# EasyEDA Pro project thighPCB.epro

# Schematic Schematic1
Board Name: Board1; Create Date: 2026-03-03; Page Name: P1; Project Name: MCU&Thigh_v2; Schematic Name: Schematic1; Update Date: 2026-03-04; BladeWidth: 10; Company: 嘉立创EDA; Page Size: A4; RegionStart: 1; ShowBorder: 1; TitleBlock: 1; TitleBlockPosition: 3; Version: V1.0; XRegionCount: 6; YRegionCount: 4
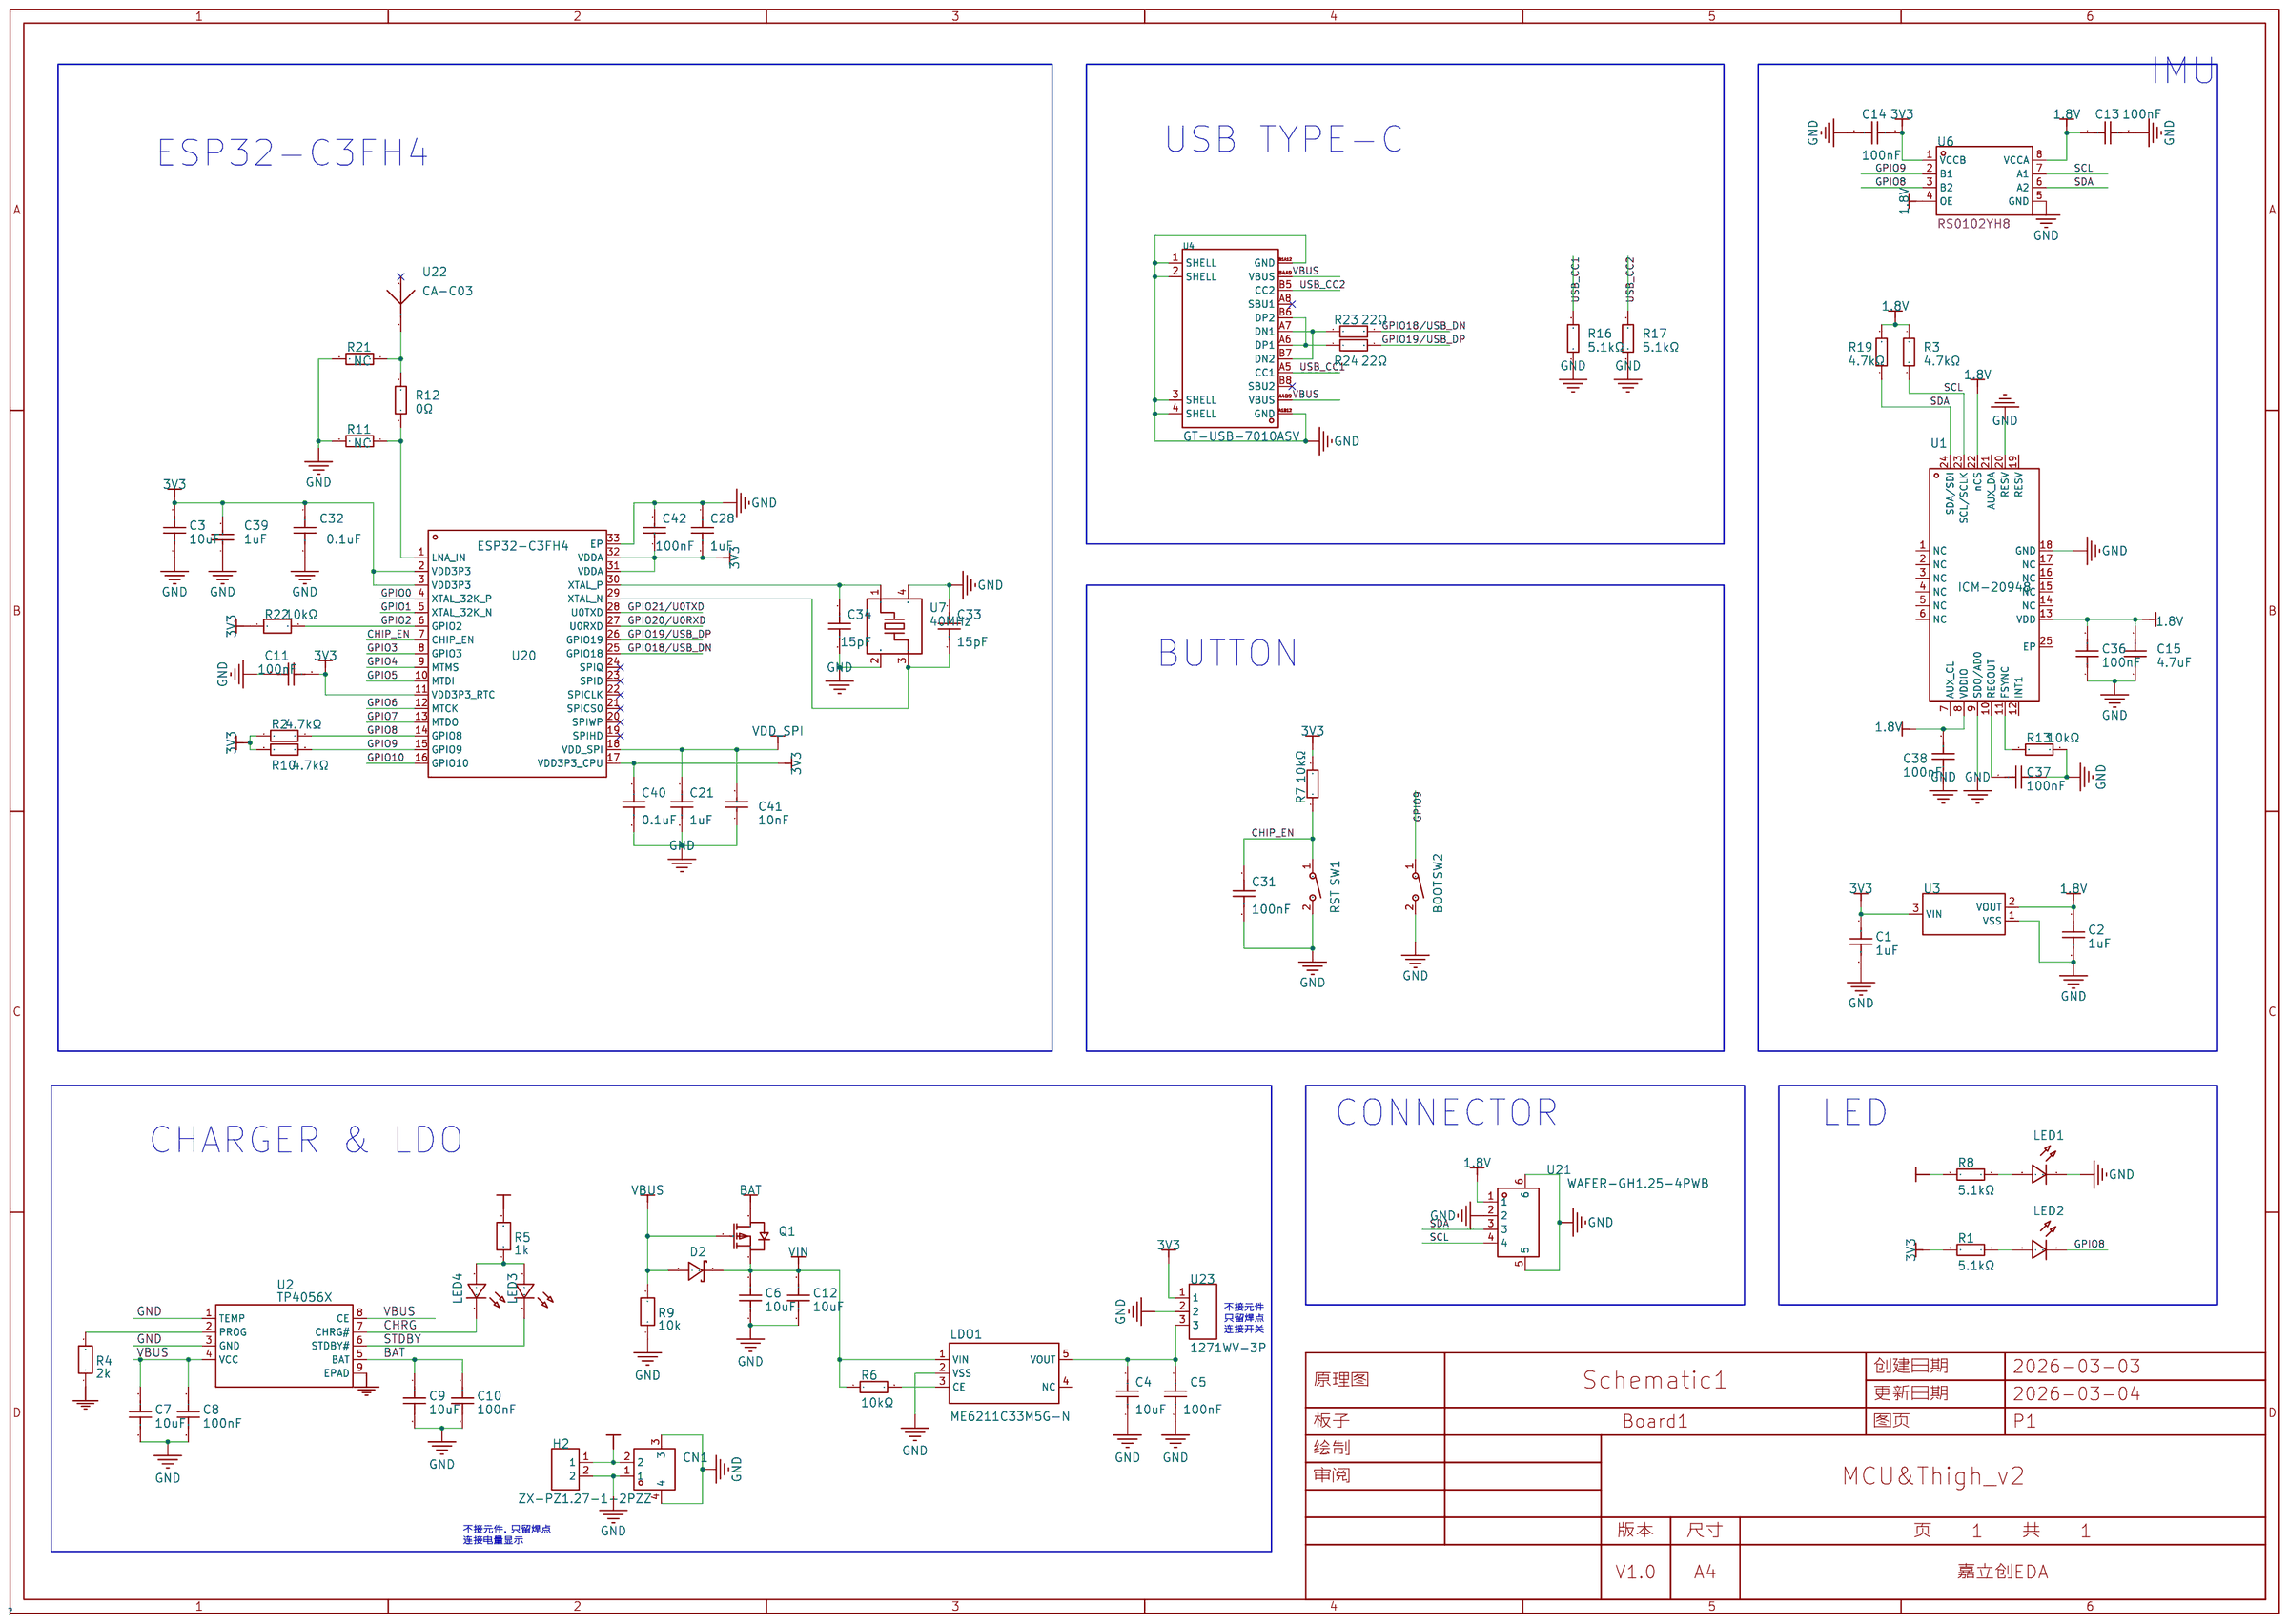
[diagram p0: schematic sheet]

## Parts
C1  1uF  [C0402]
C2  1uF  [C0402]
C3  10uF  [C0402]
C4  10uF  [C0402]
C5  100nF  [C0402]
C6  10uF  [C0402]
C7  10uF  [C0402]
C8  100nF  [C0402]
C9  10uF  [C0402]
C10  100nF  [C0402]
C11  100nF  [C0201]
C12  10uF  [C0402]
C13  100nF  [C0201]
C14  100nF  [C0201]
C15  4.7uF  [C0201]
C21  1uF  [C0201]
C28  1uF  [C0201]
C31  100nF  [C0201]
C32  0.1uF  [C0201]
C33  15pF  [C0201]
C34  15pF  [C0201]
C36  100nF  [C0201]
C37  100nF  [C0201]
C38  100nF  [C0201]
C39  1uF  [C0201]
C40  0.1uF  [C0201]
C41  10nF  [C0201]
C42  100nF  [C0201]
CN1  WAFER-GH1.25-2PWB  [CONN-TH_2P-P1.25_XUNPU_WAFER-GH1.25-2PWB]
D2  1N5819HW-7-F  [SOD-123_L2.7-W1.6-LS3.7-RD]
H2  ZX-PZ1.27-1-2PZZ  [HDR-TH_2P-P1.27-V-M-2]  (no BOM)
LDO1  ME6211C33M5G-N  [SOT-23-5_L3.0-W1.7-P0.95-LS2.8-BL]
LED1  -  [LED_0402]
LED2  -  [LED_0402]
LED3  -  [LED_0402]
LED4  -  [LED_0402]
Q1  HL6042  [SOT-23-3_L2.9-W1.4-P1.90-LS2.5-BR]
R1  5.1kΩ  [R0402]
R2  4.7kΩ  [R0201]
R3  4.7kΩ  [R0201]
R4  2k  [R0402]
R5  1k  [R0402]
R6  10kΩ  [R0402]
R7  10kΩ  [R0201]
R8  5.1kΩ  [R0402]
R9  10k  [R0402]
R10  4.7kΩ  [R0201]
R11  NC  [R0201]  (no BOM)
R12  0Ω  [R0201]
R13  10kΩ  [R0201]
R16  5.1kΩ  [R0201]
R17  5.1kΩ  [R0201]
R19  4.7kΩ  [R0201]
R21  NC  [R0201]  (no BOM)
R22  10kΩ  [R0201]
R23  22Ω  [R0201]
R24  22Ω  [R0201]
SW1  RST  [SW-SMD_L4.0-W2.9-LS5.0]
SW2  BOOT  [SW-SMD_L4.0-W2.9-LS5.0]
U1  ICM-20948  [QFN-24_L3.0-W3.0-P0.40-BL-EP]
U2  TP4056X  [SOP-8_L4.9-W3.9-P1.27-LS6.0-BL-EP]
U3  ME6211A18M3G-N  [SOT-23-3_L3.0-W1.7-P0.95-LS2.9-BR]
U4  GT-USB-7010ASV  [USB-C-SMD_G-SWITCH_GT-USB-7010ASV]
U6  RS0102YH8  [SOT-23-8_L3.0-W1.7-P0.65-LS2.8-BL]
U7  40MHz  [CRYSTAL-SMD_4P-L2.0-W1.6-BL]
U20  ESP32-C3FH4  [QFN-32_L5.0-W5.0-P0.50-TL-EP3.7]
U21  WAFER-GH1.25-4PWB  [CONN-SMD_4P-P1.25_XUNPU_WAFER-GH1.25-4PWB]
U22  CA-C03  [ANT-SMD_CA-C03]
U23  1271WV-3P  [HDR-TH_3P-P1.27-V-M]  (no BOM)

## Library data of the parts
C1 C2 C6-C10 C12 = CAP_0603: Supplier Footprint: 0603
C3 = CL05A106MP5NUNC: 容值:10uF;精度:±20%;额定电压:10V;温度系数:X5R;; LCSC Part Name: 10uF ±20% 10V; Supplier Part: C315248; Manufacturer: SAMSUNG(三星); Supplier Footprint: 0402; JLCPCB Part Class: Extended Part; Datasheet: https://item.szlcsc.com/datasheet/CL05A106MP5NUNC/297154.html; Supplier: LCSC; Tolerance: ±20%; Voltage Rating: 10V; Temperature Coefficient: X5R
C4 = CL10A106KP8NNNC: 容值:10uF;精度:±10%;额定电压:10V;材质(温度系数):X5R;; LCSC Part Name: 10uF ±10% 10V; Supplier Part: C19702; Manufacturer: SAMSUNG(三星); Supplier Footprint: 0603; JLCPCB Part Class: Basic Part; Datasheet: https://atta.szlcsc.com/upload/public/pdf/source/20160218/1457707763339.pdf; Supplier: LCSC; Tolerance: ±10%; Voltage Rated: 10V; Temperature Coefficient: X5R
C5 = CGA0603X7R104K500JT: 容值:100nF;精度:±10%;额定电压:50V;材质(温度系数):X7R;; LCSC Part Name: 100nF ±10% 50V; Supplier Part: C6119867; Manufacturer: HRE(芯声); Supplier Footprint: 0603; JLCPCB Part Class: Extended Part; Supplier: LCSC; Tolerance: ±10%; Voltage Rated: 50V; Temperature Coefficient: X7R
C11 C13 C14 C31 C32 = GRM033Z71A104KE14D: 容值:100nF;精度:±10%;额定电压:10V;材质(温度系数):X7R;; LCSC Part Name: 100nF ±10% 10V; Supplier Part: C161494; Manufacturer: muRata(村田); Supplier Footprint: 0201; JLCPCB Part Class: Extended Part; Datasheet: https://atta.szlcsc.com/upload/public/pdf/source/20181119/C161494_7C14CD1E604AF2690E90D16E0278156D.pdf; Supplier: LCSC; Tolerance: ±10%; Voltage Rated: 10V; Temperature Coefficient: X7R
C15 C36-C38 = CL03A104KO3NNNC: 容值:100nF;精度:±10%;额定电压:16V;温度系数:X5R;; LCSC Part Name: 100nF ±10% 16V; Supplier Part: C307380; Manufacturer: SAMSUNG(三星); Supplier Footprint: 0201; JLCPCB Part Class: Extended Part; Datasheet: https://item.szlcsc.com/datasheet/CL03A104KO3NNNC/291054.html; Supplier: LCSC; Tolerance: ±10%; Voltage Rating: 16V; Temperature Coefficient: X5R
C21 C28 C40 = GRM033C81A105ME05D: 容值:1uF;精度:±20%;额定电压:10V;材质(温度系数):X6S;; LCSC Part Name: 1uF ±20% 10V; Supplier Part: C237278; Manufacturer: muRata(村田); Supplier Footprint: 0201; JLCPCB Part Class: Extended Part; Datasheet: https://atta.szlcsc.com/upload/public/pdf/source/20190513/C237278_F3358F26ECB1FE4E7B7A47CC66295717.pdf; Supplier: LCSC; Tolerance: ±20%; Voltage Rated: 10V; Temperature Coefficient: X6S
C33 C34 = GRM0335C1H150FA01D: 容值:15pF;精度:±1%;额定电压:50V;材质(温度系数):C0G;; LCSC Part Name: 15pF ±1% 50V; Supplier Part: C237567; Manufacturer: muRata(村田); Supplier Footprint: 0201; JLCPCB Part Class: Extended Part; Datasheet: https://atta.szlcsc.com/upload/public/pdf/source/20190415/C237567_28BDE19A6D5FCDC5F5E36ABAB8C70B61.pdf; Supplier: LCSC; Tolerance: ±1%; Voltage Rated: 50V; Temperature Coefficient: C0G
C39 = GRM033R61A105ME44D: 容值:1uF;精度:±20%;额定电压:10V;温度系数:X5R;; LCSC Part Name: 1uF ±20% 10V; Supplier Part: C76935; Manufacturer: muRata(村田); Supplier Footprint: 0201; JLCPCB Part Class: Extended Part; Datasheet: https://item.szlcsc.com/datasheet/GRM033R61A105ME44D/78062.html; Supplier: LCSC; Tolerance: ±20%; Voltage Rating: 10V; Temperature Coefficient: X5R
C41 = GRM033R71A103KA01D: 容值:10nF;精度:±10%;额定电压:10V;材质(温度系数):X7R;; LCSC Part Name: 10nF ±10% 10V; Supplier Part: C76941; Manufacturer: muRata(村田); Supplier Footprint: 0201; JLCPCB Part Class: 扩展库; Datasheet: https://atta.szlcsc.com/upload/public/pdf/source/20180307/C76941_15204091038901407729.pdf; Supplier: LCSC; Tolerance: ±10%; Voltage Rated: 10V; Temperature Coefficient: X7R
C42 = GRM033R61E104KE14D: 容值:100nF;精度:±10%;额定电压:25V;温度系数:X5R;; LCSC Part Name: 100nF ±10% 25V; Supplier Part: C76939; Manufacturer: muRata(村田); Supplier Footprint: 0201; JLCPCB Part Class: 扩展库; Datasheet: https://item.szlcsc.com/datasheet/GRM033R61E104KE14D/78066.html; Supplier: LCSC; Tolerance: ±10%; Voltage Rating: 25V; Temperature Coefficient: X5R
CN1 = WAFER-GH1.25-2PWB: 插针结构:1x2P;间距:1.25mm;安装方式:卧贴;参考系列:GH;总PIN数:2P;排数:1;每排PIN数:2;行距:-;额定电流:1A;触头材质:黄铜;触头镀层:锡;工作温度:-25℃~+85℃;; LCSC Part Name: 1x2P 间距:1.25mm 卧贴 系列:GH; Supplier Part: C3029377; Manufacturer: XUNPU(讯普); Supplier Footprint: SMD,P=1.25mm,卧贴; JLCPCB Part Class: Extended Part; Datasheet: https://item.szlcsc.com/datasheet/WAFER-GH1.25-2PWB/3561389.html; Supplier: LCSC; Pins Structure: 1x2P; Pitch: 1.25mm; Mounting Type: 卧贴; Reference Series: GH; Number of Pins: 2P; Number of Rows: 1; Number of PINs Per Row: 2; Current Rating: 1A; Contact Material: 黄铜; Contact Plating: 锡; Operating Temperature: -25℃~+85℃; Voltage Rating: 125V; Plastic Material: LCP; Supplementary Features: 辅助焊脚; Color: 米色; Z-Height of the Board: 4.35mm; X-Length of Bottom Edge on Board (Spacing Line): 5.75mm; Y-Width of Bottom Edge on Board: 5mm
D2 = 1N5819HW-7-F: 二极管配置:1个独立式;正向压降(Vf):450mV@1A;直流反向耐压(Vr):40V;整流电流:1A;; LCSC Part Name: 电压:40V 电流:1A; Supplier Part: C82544; Manufacturer: DIODES(美台); Supplier Footprint: SOD-123; JLCPCB Part Class: Extended Part; Datasheet: https://item.szlcsc.com/datasheet/1N5819HW-7-F/83701.html; Supplier: LCSC; Diode Configuration: 1个独立式; Voltage - Forward(Vf@If): 450mV@1A; Voltage - DC Reverse(Vr): 40V; Current - Rectified: 1A; Reverse Leakage Current (Ir): 1mA@40V; Operating Junction Temperature Range: -65℃~+150℃; Non-Repetitive Peak Forward Surge Current: 25A
H2 = ZX-PZ1.27-1-2PZZ: 插针结构:1x2P;间距:1.27mm;行距:-;圆针/方针:方针;安装方式:直插;排数:单排;总PIN位数:2P;额定电流:1A;额定电压:-;配合针长度:3.9mm;塑高:1mm;端接针长度:2.3mm;触头材质:黄铜;触头镀层:金;工作温度:-40℃~+105℃;颜色:黑色;; LCSC Part Name: 1x2P 间距:1.27mm 方针 直插; Supplier Part: C41370734; Manufacturer: Megastar(兆星); Supplier Footprint: 插件,P=1.27mm; JLCPCB Part Class: 扩展库; Datasheet: https://item.szlcsc.com/datasheet/ZX-PZ1.27-1-2PZZ/43131037.html; Supplier: LCSC; Pin Structure: 1x2P; Pitch: 1.27mm; Circluar Pins/Square Pins: 方针; Mounting Type: 直插; Number of Rows: 单排; Number of Pins: 2P; Current Rating: 1A; Length of Mating Pin: 3.9mm; Insulation Height: 1mm; Length of End Connection Pin: 2.3mm; Contact Material: 黄铜; Contact Plating: 金; Operating Temperature: -40℃~+105℃; Color: 黑色
LDO1 = ME6211C33M5G-N: 输出类型:固定;工作电压:6V;输出电压:3.3V;输出电流:500mA;电源纹波抑制比(PSRR):70dB@(1kHz);输出极性:正极;; LCSC Part Name: 输入6V 输出3.3V 500mA; Supplier Part: C82942; Manufacturer: MICRONE(南京微盟); Supplier Footprint: SOT-23-5; JLCPCB Part Class: 扩展库; Datasheet: https://item.szlcsc.com/datasheet/ME6211C33M5G-N/84106.html; Supplier: LCSC; Output Type: 固定; Voltage - Supply: 6V; Output Voltage: 3.3V; Output Current: 500mA; Power Supply Rejection Ratio (PSRR): 70dB@(1kHz); Voltage Dropout: 120mV@(100mA); standby current: 60uA; Noise: 50uVrms; Features: 过流保护；带使能；短路保护; Operating Temperature: -40℃~+150℃; Output Configuration: 正极; Number of Outputs: 1
LED1 LED2 LED4 = LED_0402-R: Supplier Footprint: 0402
LED3 = LED_0402-G: Supplier Footprint: 0402
Q1 = HL6042: 数量:1个P沟道;漏源电压(Vdss):20V;连续漏极电流(Id):5A;导通电阻(RDS(on)):43mΩ@4.5V;耗散功率(Pd):1.5W;阈值电压(Vgs(th)):900mV@250uA;; LCSC Part Name: 1个P沟道 耐压:20V 电流:5A; Supplier Part: C28646264; Manufacturer: R+O(宏嘉诚); Supplier Footprint: SOT-23; JLCPCB Part Class: Extended Part; Datasheet: https://item.szlcsc.com/datasheet/HL6042/30381010.html; Supplier: LCSC; Number: 1个P沟道; Drain to Source Voltage: 20V; Current - Continuous Drain(Id): 5A; RDS(on): 43mΩ@4.5V; Pd - Power Dissipation: 1.5W; Gate Threshold Voltage (Vgs(th)): 900mV@250uA; Gate Charge(Qg): 11nC@4.5V; Input Capacitance(Ciss): 905pF; Reverse Transfer Capacitance (Crss@Vds): 115pF; Operating Temperature: -55℃~+150℃; Type: P沟道; Output Capacitance(Coss): 150pF
R1 R8 R16 R17 = RC-01W5101FT: 阻值:5.1kΩ;精度:±1%;功率:50mW;; LCSC Part Name: 5.1kΩ ±1% 50mW; Supplier Part: C320937; Manufacturer: FH(风华); Supplier Footprint: 0201; JLCPCB Part Class: Extended Part; Datasheet: https://atta.szlcsc.com/upload/public/pdf/source/20181120/C320937_0D7162DF20EC676B2B67CC3D469B426E.pdf; Supplier: LCSC; Tolerance: ±1%; Power(Watts): 50mW; Temperature Coefficient: ±200ppm/℃; Overload Voltage (Max): 25V; Operating Temperature Range: -55℃~+125℃
R2 R3 R7 R10 R13 R19 = RC0201FR-0710KL: 电阻类型:厚膜电阻;阻值:10kΩ;精度:±1%;功率:50mW;; LCSC Part Name: 10kΩ ±1% 50mW; Supplier Part: C106225; Manufacturer: YAGEO(国巨); Supplier Footprint: 0201; JLCPCB Part Class: Extended Part; Datasheet: https://atta.szlcsc.com/upload/public/pdf/source/20171221/C106225_15138309973201195185.pdf; Supplier: LCSC; Type: 厚膜电阻; Tolerance: ±1%; Power(Watts): 50mW; Temperature Coefficient: ±200ppm/℃; Overload Voltage (Max): 25V; Operating Temperature Range: -55℃~+125℃
R4 = 2k: nameAlias: Value(Ω); Contributor: LCEDA_Lib; spicePre: R; spiceSymbolName: R_0603_EU
R5 R9 = 1k: nameAlias: Value(Ω); Contributor: LCEDA_Lib; spicePre: R; spiceSymbolName: R_0603_EU
R6 = FRC0603J103TS: 电阻类型:厚膜电阻;阻值:10kΩ;精度:±5%;功率:100mW;最大工作电压:75V;温度系数:±100ppm/℃;; LCSC Part Name: 10kΩ ±5% 100mW 厚膜电阻; Supplier Part: C2930027; Manufacturer: FOJAN(富捷); Supplier Footprint: 0603; JLCPCB Part Class: Extended Part; Datasheet: https://atta.szlcsc.com/upload/public/pdf/source/20211221/925EC7D7225764EE0046F22065062C87.pdf; Supplier: LCSC; Type: 厚膜电阻; Tolerance: ±5%; Power(Watts): 100mW; Overload Voltage (Max): 75V; Temperature Coefficient: ±100ppm/℃; Operating Temperature Range: -55℃~+155℃
R11 R12 R21 = RC0201JR-070RL: 温度系数:-;工作温度范围:-55℃~+155℃;电阻长:-;精度:±5%;电阻直径:-;电阻高:-;电阻宽:-;最大工作电压:25V;电阻类型:厚膜电阻;阻值:0Ω;功率:50mW;; LCSC Part Name: 0Ω ±5%; Supplier Part: C106228; Manufacturer: YAGEO(国巨); Supplier Footprint: 0201; JLCPCB Part Class: Extended Part; Datasheet: https://atta.szlcsc.com/upload/public/pdf/source/20170912/C106228_1505207468789963235.pdf; Supplier: LCSC; Operating Temperature Range: -55℃~+155℃; Tolerance: ±5%; Overload Voltage (Max): 25V; Type: 厚膜电阻; Power(Watts): 50mW
R22 = FRC0201J103 TS: 电阻类型:厚膜电阻;阻值:10kΩ;精度:±5%;功率:50mW;温度系数:±200ppm/℃;; LCSC Part Name: 厚膜电阻 10kΩ ±5% 50mW; Supplier Part: C7467266; Manufacturer: FOJAN(富捷); Supplier Footprint: 0201; JLCPCB Part Class: 扩展库; Datasheet: https://item.szlcsc.com/datasheet/FRC0201J103%2520TS/8513882.html; Supplier: LCSC; Type: 厚膜电阻; Tolerance: ±5%; Power(Watts): 50mW; Temperature Coefficient: ±200ppm/℃
R23 R24 = RC0201FR-0722RL: 电阻类型:厚膜电阻;阻值:22Ω;精度:±1%;功率:50mW;最大工作电压:25V;温度系数:±200ppm/℃;; LCSC Part Name: 厚膜电阻 22Ω ±1% 50mW; Supplier Part: C155743; Manufacturer: YAGEO(国巨); Supplier Footprint: 0201; JLCPCB Part Class: 扩展库; Datasheet: https://atta.szlcsc.com/upload/public/pdf/source/20181009/C309620_DA5935B6E1D48212CB7A533FE518B3C2.pdf; Supplier: LCSC; Type: 厚膜电阻; Tolerance: ±1%; Power(Watts): 50mW; Overload Voltage (Max): 25V; Temperature Coefficient: ±200ppm/℃; Operating Temperature Range: -55℃~+125℃
SW1 SW2 = TS-1185-C-B-B-A: 触点电流:50mA;额定电压(DC):12V;绝缘电阻:-;电路结构:单刀单掷;安装方式:立贴;带灯:无;作用力:260gf;机械寿命:10万次;带支架:否;; LCSC Part Name: 立贴 4*3*2.5mm 轻触开关; Supplier Part: C561523; Manufacturer: XKB Connectivity(中国星坤); Supplier Footprint: SMD; JLCPCB Part Class: 扩展库; Datasheet: https://atta.szlcsc.com/upload/public/pdf/source/20211011/C2F26DC0AE1820400F54DBF49644F5A1.pdf; Supplier: LCSC; Contact Current: 50mA; Voltage Rating (DC): 12V; Circuit: 单刀单掷; Mounting Style: 立贴; Actuator Style: 圆形按钮; Actuator/Cap Color: 黑色; With Lamp: 无; Operating Force: 260gf; Mechanical Life: 10万次; Operating Temperature: -30℃~+85℃; Switch Length: 4mm; Switch Width: 3mm; Switch Height: 2.5mm; Strike Gundam: 否
U1 = ICM-20948: 传感器类型:加速度计陀螺仪;接口类型:I2C；SPI;; LCSC Part Name: 九轴MEMS运动追踪器件; Supplier Part: C726001; Manufacturer: TDK InvenSense(应美盛); Supplier Footprint: QFN-24(3x3); JLCPCB Part Class: 扩展库; Datasheet: https://item.szlcsc.com/datasheet/ICM-20948/772651.html; Supplier: LCSC; Accelerometer Sensing Axis: X,Y,Z; Acceleration Measurement Range (MAX): ±16g; Gyroscope Sensing Axis: X,Y,Z; Gyroscope Measurement Range (MAX): ±2000dps; Sensor Type: 加速度计陀螺仪; Output Bits: 16bit; Interface: I2C；SPI; Voltage - Supply: 1.71V~3.6V; Cache Size: 0.5KB; Standby Current: 8uA; Operating Temperature: -40℃~+85℃
U2 = TP4056X: Supplier: LCSC; Supplier Part: C191323; Manufacturer: Nanjing Extension Microelectronics; JLCPCB Part Class: Extended Part; Contributor: LCSC; spicePre: U
U3 = ME6211A18M3G-N: 输出类型:固定;工作电压:6V;输出电压:1.8V;输出电流:300mA;电源纹波抑制比(PSRR):70dB@(1kHz);输出极性:正极;; LCSC Part Name: 输入6V 输出1.8V 300mA; Supplier Part: C236677; Manufacturer: MICRONE(南京微盟); Supplier Footprint: SOT-23; JLCPCB Part Class: Extended Part; Datasheet: https://item.szlcsc.com/datasheet/ME6211A18M3G-N/236117.html; Supplier: LCSC; Output Type: 固定; Voltage - Supply: 6V; Output Voltage: 1.8V; Output Current: 300mA; Power Supply Rejection Ratio (PSRR): 70dB@(1kHz); Voltage Dropout: 400mV@(200mA); standby current: 30uA; Noise: 50uVrms; Features: 带使能；过流保护；短路保护; Operating Temperature: -40℃~+150℃; Output Configuration: 正极; Number of Outputs: 1
U4 = GT-USB-7010ASV: Supplier Part: C2988369; Manufacturer: G-Switch(品赞); Supplier Footprint: SMD; JLCPCB Part Class: 扩展库; Supplier: LCSC
U6 = RS0102YH8: 数据速率:24Mbps;工作电压(VCCA):1.65V~5.5V;工作电压(VCCB):2.3V~5.5V;通道数:1;每个电路通道数:2;; LCSC Part Name: 电平转换芯片; Supplier Part: C783414; Manufacturer: RUNIC(润石); Supplier Footprint: SOT-23-8; JLCPCB Part Class: Extended Part; Datasheet: https://item.szlcsc.com/datasheet/RS0102YH8/837739.html; Supplier: LCSC; Channel Type: 双向; Data Rate: 24Mbps; Voltage - Supply(VCCA): 1.65V~5.5V; Voltage - Supply(VCCB): 2.3V~5.5V; Number of Circuits: 2; Output Type: 推挽式；开漏; Operating Temperature: -40℃~+85℃
U7 = TAXM40M4ZHBCDT2T: 晶振类型:贴片晶振;频率:40MHz;常温频差:±10ppm;负载电容:15pF;频率稳定度:±20ppm;; LCSC Part Name: 40MHz ±10ppm 15pF; Supplier Part: C424432; Manufacturer: YJX(雅晶鑫); Supplier Footprint: SMD2016-4P; JLCPCB Part Class: Extended Part; Datasheet: https://item.szlcsc.com/datasheet/TAXM40M4ZHBCDT2T/417823.html; Supplier: LCSC; Type: 贴片晶振; Normal temperature Frequency Tolerance: ±10ppm; Load Capacitance: 15pF; Frequency Stability: ±20ppm; Equivalent Series Resistance(ESR): 40Ω; Operating Temperature: -40℃~+85℃
U20 = ESP32-C3FH4: Supplier Part: C2858491; Manufacturer: ESPRESSIF(乐鑫); Supplier Footprint: QFN-32-EP(5x5); JLCPCB Part Class: 扩展库; Datasheet: https://item.szlcsc.com/datasheet/ESP32-C3FH4/3060870.html; Supplier: LCSC
U21 = WAFER-GH1.25-4PWB: 插针结构:1x4P;间距:1.25mm;安装方式:卧贴;参考系列:GH;总PIN数:4P;排数:1;每排PIN数:4;行距:-;额定电流:1A;触头材质:黄铜;触头镀层:锡;工作温度:-25℃~+85℃;; LCSC Part Name: 1x4P 间距:1.25mm 卧贴 系列:GH; Supplier Part: C3029379; Manufacturer: XUNPU(讯普); Supplier Footprint: SMD,P=1.25mm,卧贴; JLCPCB Part Class: 扩展库; Datasheet: https://item.szlcsc.com/datasheet/WAFER-GH1.25-4PWB/3561391.html; Supplier: LCSC; Pins Structure: 1x4P; Pitch: 1.25mm; Mounting Type: 卧贴; Reference Series: GH; Number of Pins: 4P; Number of Rows: 1; Number of PINs Per Row: 4; Current Rating: 1A; Contact Material: 黄铜; Contact Plating: 锡; Operating Temperature: -25℃~+85℃; Voltage Rating: 125V; Plastic Material: LCP; Supplementary Features: 辅助焊脚; Color: 米色; Z-Height of the Board: 4.35mm; X-Length of Bottom Edge on Board (Spacing Line): 8.25mm; Y-Width of Bottom Edge on Board: 5mm
U22 = CA-C03_C9900042552: Supplier Part: C9900042552; Supplier Footprint: SMD; Datasheet: https://atta.szlcsc.com/upload/public/pdf/source/20240814/EE4922E92F71155A2C6E8639C6BFA7CA.pdf; Supplier: LCSC
U23 = 1271WV-3P: 插针结构:1x3P;间距:1.27mm;圆针/方针:方针;安装方式:直插;排数:单排;总PIN位数:3P;配合针长度:4mm;塑高:1mm;端接针长度:2.2mm;触头镀层:金;工作温度:-40℃~+105℃;; LCSC Part Name: 1x3P 间距:1.27mm 方针 直插; Supplier Part: C7470079; Manufacturer: HanElectricity(瀚源); Supplier Footprint: 插件,P=1.27mm; JLCPCB Part Class: 扩展库; Datasheet: https://item.szlcsc.com/datasheet/1271WV-3P/8518992.html; Supplier: LCSC; Pin Structure: 1x3P; Pitch: 1.27mm; Circluar Pins/Square Pins: 方针; Mounting Type: 直插; Number of Rows: 单排; Number of Pins: 3P; Length of Mating Pin: 4mm; Insulation Height: 1mm; Length of End Connection Pin: 2.2mm; Contact Plating: 金; Operating Temperature: -40℃~+105℃

## Nets
1.8V: C2.1 C13.1 C15.2 C36.2 C38.2 R3.1 R19.2 U1.8(VDDIO) U1.13(VDD) U1.22(nCS) U3.2(VOUT) U6.4(OE) U6.8(VCCA) U21.1
3V3: C1.1 C3.2 C11.2 C14.1 C28.2 C32.1 C39.2 C40.1 C42.2 R1.2 R2.1 R7.2 R10.1 R22.1 U3.3(VIN) U6.1(VCCB) U20.2(VDD3P3) U20.3(VDD3P3) U20.11(VDD3P3_RTC) U20.17(VDD3P3_CPU) U20.31(VDDA) U20.32(VDDA) U23.1
GND: C1.2 C2.2 C3.1 C4.1 C5.1 C6.1 C7.2 C8.2 C9.2 C10.2 C11.1 C12.1 C13.2 C14.2 C15.1 C21.2 C28.1 C31.2 C32.2 C33.1 C34.2 C36.1 C37.1 C38.1 C39.1 C40.2 C41.1 C42.1 CN1.1 CN1.3 CN1.4 H2.2 LDO1.2(VSS) LED1.1(C) R4.1 R9.1 R11.2 R13.2 R16.1 R17.1 R21.2 SW1.2 SW2.2 U1.9(SDO/AD0) U1.18(GND) U1.20(RESV) U2.1(TEMP) U2.3(GND) U2.9(EPAD) U3.1(VSS) U4.1(SHELL) U4.2(SHELL) U4.3(SHELL) U4.4(SHELL) U4.A1B12(GND) U4.B1A12(GND) U6.5(GND) U7.2(GND) U7.4(GND) U20.33(EP) U21.2 U21.5 U21.6 U23.2
VBUS: C7.1 C8.1 D2.2(A) Q1.1(G) R5.2 R8.2 R9.2 U2.4(VCC) U2.8(CE) U4.A4B9(VBUS) U4.B4A9(VBUS)
VDD_SPI: C21.1 C41.2 U20.18(VDD_SPI)
VIN: C6.2 C12.2 D2.1(K) LDO1.1(VIN) Q1.2(S) R6.1
BAT: C9.1 C10.1 CN1.2 H2.1 Q1.3(D) U2.5(BAT)
CHIP_EN: C31.1 R7.1 SW1.1 U20.7(CHIP_EN)
CHRG: LED4.1(C) U2.7(CHRG#)
GPIO0: U20.4(XTAL_32K_P)
GPIO1: U20.5(XTAL_32K_N)
GPIO2: R22.2 U20.6(GPIO2)
GPIO3: U20.8(GPIO3)
GPIO4: U20.9(MTMS)
GPIO5: U20.10(MTDI)
GPIO6: U20.12(MTCK)
GPIO7: U20.13(MTDO)
GPIO8: LED2.1(C) R2.2 U6.3(B2) U20.14(GPIO8)
GPIO9: R10.2 SW2.1 U6.2(B1) U20.15(GPIO9)
GPIO10: U20.16(GPIO10)
GPIO18/USB_DN: R23.2 U20.25(GPIO18)
GPIO19/USB_DP: R24.2 U20.26(GPIO19)
GPIO20/U0RXD: U20.27(U0RXD)
GPIO21/U0TXD: U20.28(U0TXD)
SCL: R3.2 U1.23(SCL/SCLK) U6.7(A1) U21.4
SDA: R19.1 U1.24(SDA/SDI) U6.6(A2) U21.3
STDBY: LED3.1(C) U2.6(STDBY#)
USB_CC1: R16.2 U4.A5(CC1)
USB_CC2: R17.2 U4.B5(CC2)
$1N3228: LDO1.3(CE) R6.2
$1N3230: C4.2 C5.2 LDO1.5(VOUT) U23.3
$1N3241: LED1.2(A) R8.1
$1N3249: R24.1 U4.A6(DP1) U4.B6(DP2)
$1N3250: R23.1 U4.A7(DN1) U4.B7(DN2)
$1N3275: C34.1 U7.1 U20.30(XTAL_P)
$1N3278: R11.1 R12.1 U20.1(LNA_IN)
$1N3279: R12.2 R21.1 U22.1
$1N3283: C33.2 U7.3 U20.29(XTAL_N)
$1N3292: LED2.2(A) R1.1
$1N3304: C37.2 U1.10(REGOUT)
$1N7546: LED3.2(A) LED4.2(A) R5.1
$1N7554: R4.2 U2.2(PROG)
$1N7596: R13.1 U1.11(FSYNC)

Not connected (* = marked no-connect by the designer): LDO1 4(NC); U1 1(NC) 2(NC) 3(NC) 4(NC) 5(NC) 6(NC) 7(AUX_CL) 12(INT1) 14(NC) 15(NC) 16(NC) 17(NC) 19(RESV) 21(AUX_DA) 25(EP); U4 A8(SBU1)* B8(SBU2)*; U20 19(SPIHD)* 20(SPIWP)* 21(SPICS0)* 22(SPICLK)* 23(SPID)* 24(SPIQ)*; U22 2(ANT)*

## Notes on the sheet
- IMU
- USB TYPE-C
- ESP32-C3FH4
- BUTTON
- CONNECTOR
- LED
- CHARGER & LDO
- 不接元件
  只留焊点
  连接开关
- 不接元件，只留焊点
  连接电量显示

# Board PCB1
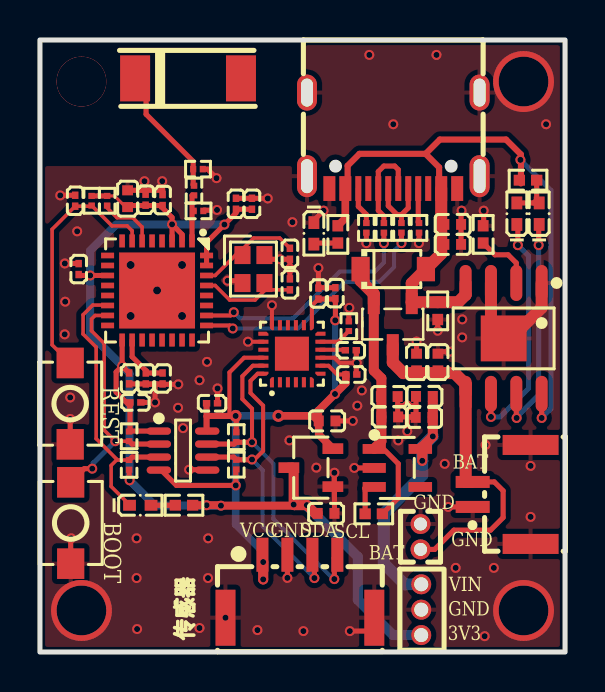
[diagram p1: board, top side]
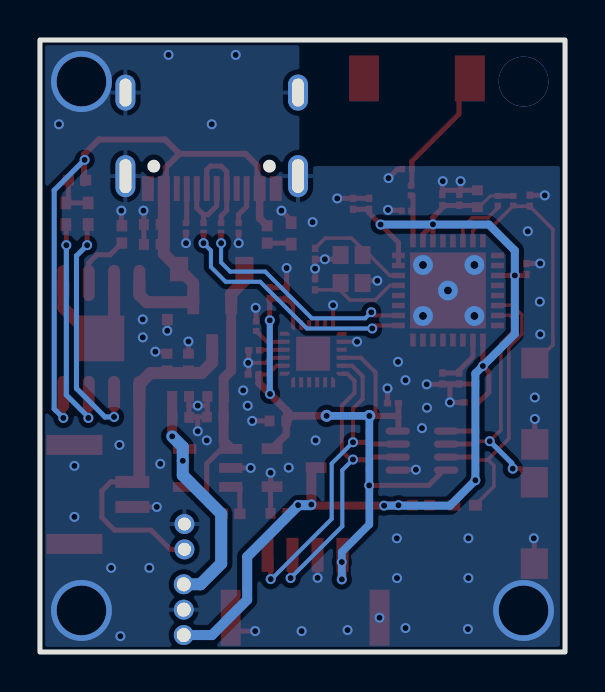
[diagram p2: board, bottom side, seen from below]

Outline 26.29 x 30.61 mm; copper layers: Top Layer, Bottom Layer. Coordinates in mm from the lower left corner of the outline.
Outline path: rectangle 0,30.61 26.29,0
Stack: Top Layer 0.035mm / Dielectric1 1.51mm FR4 er 4.5 / Bottom Layer 0.035mm

## Design rules (mm)
spacing copperThickness1oz (default): track to track 0.152, other pairs 0.127 to 0.203
spacing copperThickness2oz: track to track 0.203, other pairs 0.152 to 0.3
spacing Plane_innerPlane: track to track 0.102, other pairs 0.152 to 0.3
spacing Copper_copperRegion: track to track 0.102, other pairs 0.152 to 0.3
track width copperThickness1oz (default): min 0.127, default 0.254, max 2.54
track width copperThickness2oz: min 0.203, default 0.254, max 2.54
differential pair differentialPair (default): width min 0.127, default 0.254, max 2.54; gap min 0.152, default 0.152
net GND uses copperRegion_copperThickness1oz
pour e820 uses Copper_copperRegion, copperRegion_Copper_copperRegion
pour e910 uses Copper_copperRegion, copperRegion_Copper_copperRegion

## Placement (name value [footprint] x y rotation side)
C1  1uF  [C0402]  14.33 6.93 0 top
C2  1uF  [C0402]  14.38 11.56 0 top
C3  10uF  [C0402]  4.39 22.67 270 top
C4  10uF  [C0402]  19.23 11.73 0 top
C5  100nF  [C0402]  19.25 12.78 0 top
C6  10uF  [C0402]  17.51 11.76 180 top
C7  10uF  [C0402]  20.66 21.39 0 top
C8  100nF  [C0402]  20.66 20.39 0 top
C9  10uF  [C0402]  18.85 14.5 90 top
C10  100nF  [C0402]  19.93 14.5 90 top
C11  100nF  [C0201]  1.94 19.15 270 top
C12  10uF  [C0402]  17.49 12.78 180 top
C13  100nF  [C0201]  8.62 12.44 0 top
C14  100nF  [C0201]  4.78 12.48 0 top
C15  4.7uF  [C0201]  14.79 17.95 270 top
C21  1uF  [C0201]  6.14 13.68 270 top
C28  1uF  [C0201]  9.81 22.41 270 top
C31  100nF  [C0201]  1.76 22.57 90 top
C32  0.1uF  [C0201]  5.29 22.62 90 top
C33  15pF  [C0201]  12.51 18.39 270 top
C34  15pF  [C0201]  12.51 19.92 270 top
C36  100nF  [C0201]  13.94 17.93 270 top
C37  100nF  [C0201]  15.56 15.09 180 top
C38  100nF  [C0201]  15.59 13.88 180 top
C39  1uF  [C0201]  6.14 22.6 270 top
C40  0.1uF  [C0201]  4.46 13.68 270 top
C41  10nF  [C0201]  5.3 13.68 90 top
C42  100nF  [C0201]  10.61 22.41 270 top
CN1  WAFER-GH1.25-2PWB  [CONN-TH_2P-P1.25_XUNPU_WAFER-GH1.25-2PWB]  23.11 7.88 90 top
D2  1N5819HW-7-F  [SOD-123_L2.7-W1.6-LS3.7-RD]  17.69 19.15 0 top
H2  ZX-PZ1.27-1-2PZZ  [HDR-TH_2P-P1.27-V-M-2]  19.05 5.77 90 top
LDO1  ME6211C33M5G-N  [SOT-23-5_L3.0-W1.7-P0.95-LS2.8-BL]  17.89 9.21 270 top
LED1  -  [LED_0402]  13.71 20.94 270 top
LED2  -  [LED_0402]  5.02 7.34 0 top
LED3  -  [LED_0402]  23.88 21.92 90 top
LED4  -  [LED_0402]  24.99 21.92 90 top
Q1  HL6042  [SOT-23-3_L2.9-W1.4-P1.90-LS2.5-BR]  17.66 16.4 90 top
R1  5.1kΩ  [R0402]  7.21 7.34 0 top
R2  4.7kΩ  [R0201]  4.46 9.36 90 top
R3  4.7kΩ  [R0201]  9.83 10.74 270 top
R4  2k  [R0402]  22.19 20.89 270 top
R5  1k  [R0402]  24.44 23.6 180 top
R6  10kΩ  [R0402]  16.71 6.91 180 top
R7  10kΩ  [R0201]  2.59 22.57 90 top
R8  5.1kΩ  [R0402]  14.91 20.89 90 top
R9  10k  [R0402]  19.91 17.06 90 top
R10  4.7kΩ  [R0201]  4.46 10.79 270 top
R11  NC  [R0201]  7.94 22.06 0 top
R12  0Ω  [R0201]  7.71 23.08 90 top
R13  10kΩ  [R0201]  15.46 16.3 90 top
R16  5.1kΩ  [R0201]  18.98 21.21 90 top
R17  5.1kΩ  [R0201]  16.34 21.21 90 top
R19  4.7kΩ  [R0201]  9.83 9.37 270 top
R21  NC  [R0201]  7.91 24.15 0 top
R22  10kΩ  [R0201]  3.36 22.57 270 top
R23  22Ω  [R0201]  18.1 21.21 270 top
R24  22Ω  [R0201]  17.22 21.21 270 top
SW1  RST  [SW-SMD_L4.0-W2.9-LS5.0]  1.51 12.42 270 top
SW2  BOOT  [SW-SMD_L4.0-W2.9-LS5.0]  1.54 6.45 270 top
U1  ICM-20948  [QFN-24_L3.0-W3.0-P0.40-BL-EP]  12.61 14.92 0 top
U2  TP4056X  [SOP-8_L4.9-W3.9-P1.27-LS6.0-BL-EP]  23.21 15.68 180 top
U3  ME6211A18M3G-N  [SOT-23-3_L3.0-W1.7-P0.95-LS2.9-BR]  13.56 9.22 0 top
U4  GT-USB-7010ASV  [USB-C-SMD_G-SWITCH_GT-USB-7010ASV]  17.69 25.58 180 top
U6  RS0102YH8  [SOT-23-8_L3.0-W1.7-P0.65-LS2.8-BL]  7.16 10.07 270 top
U7  40MHz  [CRYSTAL-SMD_4P-L2.0-W1.6-BL]  10.69 19.15 270 top
U20  ESP32-C3FH4  [QFN-32_L5.0-W5.0-P0.50-TL-EP3.7]  5.86 18.08 270 top
U21  WAFER-GH1.25-4PWB  [CONN-SMD_4P-P1.25_XUNPU_WAFER-GH1.25-4PWB]  13.01 3.29 0 top
U22  CA-C03  [ANT-SMD_CA-C03]  7.41 28.69 180 top
U23  1271WV-3P  [HDR-TH_3P-P1.27-V-M]  19.09 2.12 90 top

## Footprints (pads in the part's own frame, mm; a bottom-side part is the same pattern mirrored in y, then rotated)
ANT-SMD_CA-C03
  rect 1.5x2.3 smd: 1(2.65,0) 2(-2.65,0)
C0201
  rect 0.368x0.324 smd: 1(-0.275,0) 2(0.275,0)
C0402
  rect 0.5x0.54 smd: 1(-0.42,0) 2(0.42,0)
CONN-SMD_4P-P1.25_XUNPU_WAFER-GH1.25-4PWB
  rect 0.6x1.7 smd: 1(-1.875,1.575) 2(-0.625,1.575) 3(0.625,1.575) 4(1.875,1.575)
  rect 1x2.8 smd: 5(3.725,-1.575) 6(-3.725,-1.575)
CONN-TH_2P-P1.25_XUNPU_WAFER-GH1.25-2PWB
  rect 0.6x1.7 smd: 1(-0.625,1.45) 2(0.625,1.45)
  rect 1x2.8 smd: 3(-2.475,-1.45) 4(2.475,-1.45)
CRYSTAL-SMD_4P-L2.0-W1.6-BL
  rect 0.9x0.8 smd: 1(-0.7,-0.55) 2(0.7,-0.55) 3(0.7,0.55) 4(-0.7,0.55)
HDR-TH_2P-P1.27-V-M-2
  round 1 hole 0.65: 1(-0.635,0) 2(0.635,0)
HDR-TH_3P-P1.27-V-M
  round 1 hole 0.7: 1(-1.27,0) 2(0,0) 3(1.27,0)
LED_0402
  rect 0.637x0.541 smd: 1(-0.538,0) 2(0.538,0)
QFN-24_L3.0-W3.0-P0.40-BL-EP
  custom 0.2x0.506 smd: 1(-1,-1.427) 6(1,-1.427) 13(1,1.427) 18(-1,1.427)
  rect 0.2x0.505 smd: 2(-0.6,-1.427) 3(-0.2,-1.427) 4(0.2,-1.427) 5(0.6,-1.427) 14(0.6,1.427) 15(0.2,1.427) 16(-0.2,1.427) 17(-0.6,1.427)
  custom 0.506x0.2 smd: 7(1.427,-1) 12(1.427,1) 19(-1.427,1) 24(-1.427,-1)
  rect 0.505x0.2 smd: 8(1.427,-0.6) 9(1.427,-0.2) 10(1.427,0.2) 11(1.427,0.6) 20(-1.427,0.6) 21(-1.427,0.2) 22(-1.427,-0.2) 23(-1.427,-0.6)
  rect 1.7x1.7 smd: 25(0,0)
QFN-32_L5.0-W5.0-P0.50-TL-EP3.7
  rect 0.65x0.28 smd: 1(-2.478,1.75) 2(-2.478,1.25) 3(-2.478,0.75) 4(-2.478,0.25) 5(-2.478,-0.25) 6(-2.478,-0.75) 7(-2.478,-1.25) 8(-2.478,-1.75) 17(2.478,-1.75) 18(2.478,-1.25) 19(2.478,-0.75) 20(2.478,-0.25) 21(2.478,0.25) 22(2.478,0.75) 23(2.478,1.25) 24(2.478,1.75)
  rect 0.28x0.65 smd: 9(-1.75,-2.478) 10(-1.25,-2.478) 11(-0.75,-2.478) 12(-0.25,-2.478) 13(0.25,-2.478) 14(0.75,-2.478) 15(1.25,-2.478) 16(1.75,-2.478) 25(1.75,2.478) 26(1.25,2.478) 27(0.75,2.478) 28(0.25,2.478) 29(-0.25,2.478) 30(-0.75,2.478) 31(-1.25,2.478) 32(-1.75,2.478)
  rect 3.8x3.8 smd: 33(0,0)
R0201
  rect 0.303x0.324 smd: 1(-0.241,0) 2(0.241,0)
R0402
  rect 0.566x0.54 smd: 1(-0.433,0) 2(0.433,0)
SOD-123_L2.7-W1.6-LS3.7-RD
  rect 0.91x1.22 smd: 1(-1.635,0) 2(1.635,0)
SOP-8_L4.9-W3.9-P1.27-LS6.0-BL-EP
  oval 0.6x1.8 smd: 1(-1.905,-2.772) 2(-0.635,-2.772) 3(0.635,-2.772) 4(1.905,-2.772) 5(1.905,2.772) 6(0.635,2.772) 7(-0.635,2.772) 8(-1.905,2.772)
  rect 2.29x2.29 smd: 9(0,0)
SOT-23-3_L2.9-W1.4-P1.90-LS2.5-BR
  rect 1.07x0.6 smd: 1(1.035,-0.95) 2(1.035,0.95) 3(-1.035,0)
SOT-23-3_L3.0-W1.7-P0.95-LS2.9-BR
  rect 1.038x0.532 smd: 1(1.101,-0.95) 2(1.101,0.95) 3(-1.101,0)
SOT-23-5_L3.0-W1.7-P0.95-LS2.8-BL
  rect 0.49x1.157 smd: 1(-0.95,-1.153) 2(0,-1.153) 3(0.95,-1.153)
  rect 0.49x1.175 smd: 4(0.95,1.153) 5(-0.95,1.153)
SOT-23-8_L3.0-W1.7-P0.65-LS2.8-BL
  oval 0.364x1.222 smd: 1(-0.975,-1.211) 2(-0.325,-1.211) 3(0.325,-1.211) 4(0.975,-1.211) 5(0.975,1.211) 6(0.325,1.211) 7(-0.325,1.211) 8(-0.975,1.211)
SW-SMD_L4.0-W2.9-LS5.0
  rect 1.53x1.36 smd: 1(-2.035,0) 2(2.035,0)
USB-C-SMD_G-SWITCH_GT-USB-7010ASV
  oval 1x2.1 hole 0.6x1.7: 1(-4.32,1.78) 2(4.32,1.78)
  oval 1x1.8 hole 0.6x1.4: 3(4.32,-2.4) 4(-4.32,-2.4)
  rect 0.6x1.24 smd: A1B12(-3.2,2.4) A4B9(-2.4,2.4) B1A12(3.2,2.4) B4A9(2.4,2.4)
  rect 0.3x1.24 smd: A5(-1.25,2.4) A6(-0.25,2.4) A7(0.25,2.4) A8(1.25,2.4) B5(1.75,2.4) B6(0.75,2.4) B7(-0.75,2.4) B8(-1.75,2.4)

## Nets
As in the schematic.

Pads without a net: LDO1 4; U1 1 2 3 4 5 6 7 12 14 15 16 17 19 21 25; U4 A8 B8; U20 19 20 21 22 23 24; U22 2

## Via types
v1: diameter 2.489, hole 2.489, Top Layer to Bottom Layer, 1 via
v2: diameter 0.5, hole 0.305, Top Layer to Bottom Layer, 105 vias
v3: diameter 1, hole 0.4, Top Layer to Bottom Layer, 5 vias
v4: diameter 3.048, hole 2.489, Top Layer to Bottom Layer, 3 vias
v5: diameter 0.6, hole 0.305, Top Layer to Bottom Layer, 2 vias

## Routing (per net, layer and track width the routed paths; a pad name or vN(x,y) marks a point on that pad's centre or on a via; arc(x,y) is an arc through that point)
1.8V: length 40.2
  Top Layer w0.2: 15.29,13.88 14.89,13.88 14.45,14.32 U1.8
  Top Layer w0.203: 11.19,14.72 10.22,14.72 9.49,13.98 9.49,11.81 ; C36.2 13.61,17.33 U1.13
  Top Layer w0.254: 9.83,10.99 9.83,11.77 v5(9.8,11.81) ; R19.2 9.8,9.11 v2(9.8,8.33) 6.83,8.33 6.07,9.1 U6.4 ; v2(14.78,16.59) 14.79,16.59 C15.2 14.77,17.65 C36.2
  Top Layer w0.305: 8.34,11.79 8.34,11.08 U6.8 ; 8.34,11.79 C13.1 ; 8.34,11.79 8.36,11.81 v5(9.8,11.81)
  Top Layer w0.381: 13.94,12.07 v2(14.77,12.9) 15.32,13.45 C38.2 ; 13.94,12.07 13.68,11.81 ; 13.94,12.07 13.94,11.58 C2.1 13.96,11.53 ; 13.96,11.53 13.96,10.88 U3.2 ; 13.96,11.53 13.68,11.81 ; 13.68,11.81 v5(11.94,11.81)
  Top Layer w0.508: v2(11.18,4.5) v2(11.18,3.63)
  Bottom Layer w0.305: v2(14.77,12.9) 14.78,12.92 v2(14.78,16.59)
  Bottom Layer w0.381: v2(11.18,3.63) v2(11.18,4.5) 11.18,5 9.8,6.38 v5(9.8,11.81) 9.8,11.81 v5(11.94,11.81)
3V3: length 64.3
  Top Layer w0.152: C3.2 4.29,22.25 3.73,22.81 R22.1
  Top Layer w0.254: U20.31 U20.32 8.34,20.48 v2(9.23,21.38) 9.81,21.95 C28.2 10.45,22.14 ; 4.5,12.3 4.5,11.07 4.48,11.05 ; 4.5,12.3 C14.1 ; 4.5,12.3 3.81,12.99 3.81,14 v2(4.11,14.3) ; U20.3 v2(6.61,21.39) ; v2(6.61,21.39) 6.61,21.73 6.02,22.33 ; v2(6.61,21.39) 7.11,20.89 U20.2 ; R7.2 R22.1 ; U6.1 4.48,11.05 ; 4.48,11.05 R10.1 ; 6.02,22.33 C39.2 ; 6.02,22.33 5.31,22.33 ; R2.1 4.46,8.61 v2(4.49,8.59) ; U20.11 v2(2.52,18.83) 1.99,18.83 C11.2 ; 5.31,22.33 C32.1 ; 5.31,22.33 4.47,22.33 C3.2 ; v2(4.11,14.3) U20.17 ; v2(4.11,14.3) C40.1 ; 7.64,7.34 7.93,7.34
  Top Layer w0.4: 13.39,7.32 v2(9.06,7.32) 9.04,7.34 v2(8.34,7.34) 7.93,7.34
  Top Layer w0.5: C1.1 13.78,6.93 v2(13.36,7.35) 12.73,7.35 v2(12.7,7.37) 12.7,9.17 12.65,9.22 U3.3
  Bottom Layer w0.4: 6.63,21.38 v2(6.61,21.39) ; 6.63,21.38 v2(9.23,21.38) ; 6.63,21.38 3.81,21.38 2.52,20.08 v2(2.52,18.83) 2.52,15.9 v2(4.11,14.3) 4.49,13.93 v2(4.49,8.59) 5.76,7.32 v2(9.06,7.32)
  Bottom Layer w0.5: U23.1 17.68,0.85 15.91,2.61 15.91,4.76 13.36,7.31 v2(13.36,7.35) 12.73,7.35 v2(12.7,7.37)
GND: length 51.4
  Top Layer w0.2: U1.18 11.61,16.35 ; 14.04,14.72 14.75,14.72 15,14.46 v2(15.86,14.46) ; 11.19,15.52 v2(10.41,15.52)
  Top Layer w0.203: U1.18 v2(11.61,17.34)
  Top Layer w0.254: 5.78,13.39 v2(6.93,13.39) ; 5.78,13.39 5.8,13.41 ; 5.78,13.39 5.32,13.39 5.3,13.41 ; 5.78,13.39 5.76,13.36 v2(5.76,12.48) C14.2 ; v2(18.97,20.45) 18.98,20.45 R16.1 ; v2(6.12,23.55) 6.14,23.53 6.14,23.09 ; C4.1 18.83,11.75 18.83,12.32 ; 5.17,23.09 6.14,23.09 ; 5.17,23.09 5.23,23.15 v2(5.23,23.55) ; 5.17,23.09 C3.1 ; 6.14,23.09 C39.1 ; 6.14,23.09 6.15,23.09 ; 18.83,12.32 18.39,12.32 v2(18.39,12.32) 17.91,12.32 ; 18.83,12.32 C5.1 ; 15.84,14.49 C37.1 ; 15.84,14.49 v2(15.86,14.46) ; 15.84,14.49 15.84,13.91 15.86,13.88 ; v2(7.47,9.12) 8.35,9.12 U6.5 ; v2(14.2,22.07) 13.71,21.59 LED1.1 ; v2(11.4,22.68) 11.4,22.69 C42.1 C28.1 ; 17.91,12.32 17.91,11.78 C6.1 18.39,11.76 ; 17.91,12.32 C12.1 ; 18.56,11.73 18.54,11.76 18.39,11.76 ; SW2.2 1.54,5.66 v2(1.56,5.69) ; C2.2 v2(15.66,11.56) ; 5.3,13.41 5.8,13.41 ; 5.3,13.41 4.46,13.41 ; 21.08,20.39 21.08,22.05 v2(21.11,22.07) ; C31.2 1.02,22.84 v2(1.02,22.83) ; 8.18,22.06 8.21,22.09 8.85,22.09 v2(8.86,22.11) ; v2(15.49,17.21) 15.46,17.19 R13.2 ; SW1.2 v2(1.51,11.65) ; v2(22.21,22.07) 22.21,21.34 R4.1 ; U7.2 10.02,18.57 v2(9.4,18.57) ; 6.14,13.41 5.8,13.41 ; 18.39,11.76 v2(18.39,11.04) ; 21.61,7.25 v2(20.44,7.25) ; v2(13.94,19.2) C36.1 13.96,18.22 C15.1 ; C33.1 v2(12.51,19.17) C34.2 v2(12.03,19.64) 11.45,19.64 U7.4 ; C11.1 1.93,19.43 v2(1.24,19.43) ; R9.1 v2(19.91,16.07) ; C10.2 20.03,15.02 v2(20.51,15.02) ; U21.2 v2(12.39,3.71) ; R21.2 8.39,24.15 v2(8.84,23.7) ; C9.2 v2(18.85,15.53) ; R17.1 v2(16.34,20.45) ; C1.2 14.75,8.19 U3.1 14.74,8.35 v2(14.74,8.97) ; C13.2 v2(8.89,13.18) ; v2(15.51,1.05) 16.74,1.05 U21.5 ; LDO1.2 v2(15.74,9.21)
  Top Layer w0.6: U2.1 25.12,17.22 24.08,16.18 23.71,16.18 ; U2.3 22.58,16.32 22.71,16.18
  vias: v2(1.26,17.52) v2(1.24,15.89) v2(1.51,12.73) v2(1.86,21.04) v2(4.84,5.69) v2(4.84,3.7) v2(4.86,1.15) v2(6.91,12.22) v2(7.16,11.19) v2(7.99,13.59) v2(7.99,1.2) v2(8.36,14.51) v2(8.42,5.69) v2(8.41,3.7) v2(9.29,1.72) v2(10.89,1.1) v2(12.49,10.58) v2(12.64,21.5) v2(13.19,1.05) v2(13.84,9.22) v2(15.89,12.32) v2(16.11,13.08) v2(16.49,29.86) v2(17.69,26.39) v2(17.94,10.58) v2(19.85,29.86) v2(20.26,9.41) v2(20.81,4.21) v2(21.14,16.63) v2(21.14,15.73) v2(22.31,10.36) v2(22.26,0.79) v2(22.72,4.21) v2(24.56,9.31) v2(24.56,6.76) v2(25.34,26.39) v3(4.54,19.36) v3(4.54,16.8) v3(5.86,18.08) v3(7.11,19.36) v3(7.11,16.8) v4(2.08,2.08) v4(24.21,28.53) v4(24.21,2.08)
VBUS: length 41
  Top Layer w0.254: U2.8 v2(25.12,11.7)
  Top Layer w0.305: 24.08,23.44 24.08,24.88 23.33,25.63 20.02,25.63 19.31,24.91 ; 19.31,24.91 16,24.91 15.4,24.32 15.4,23.29 U4.B4A9 ; 19.31,24.91 19.98,24.24 19.98,23.71 20.09,23.61 U4.A4B9
  Top Layer w0.381: U4.B4A9 15.29,21.69 R8.2
  Top Layer w0.6: U4.A4B9 20.09,19.92 18.61,18.44 18.61,17.49 ; 18.61,17.49 R9.2 20.94,17.49 21.31,17.86 U2.4 ; 18.61,17.49 Q1.1
  Bottom Layer w0.254: v2(25.12,11.7) 25.58,12.16 25.58,23.09 v2(24.05,24.61)
VDD_SPI: length 2.8
  Top Layer w0.254: C21.1 C41.2 5.3,14.08 4.61,14.77 U20.18
VIN: length 13.9
  Top Layer w0.254: R6.1 17.94,7.7 17.94,9.42 17.09,10.26 17.09,10.54
  Top Layer w0.5: 16.74,10.16 16.74,10.18 17.09,10.54 17.09,13.69 16.71,14.07 Q1.2
  Top Layer w0.6: Q1.2 16.71,17.91 16.05,18.57 D2.1
(no net):
  vias: v1(2.08,28.53)
BAT: length 18.5
  Top Layer w0.254: 21.61,8.5 22.75,8.5 23.19,8.06 23.19,6.72 22.56,6.09 20.72,6.09 19.76,5.13 H2.1
  Top Layer w0.6: Q1.3 17.66,14.48 18.19,13.95 20.76,13.95 21.31,13.4 ; 21.31,13.4 U2.5 ; 21.31,13.4 21.31,13.39 21.31,8.5 21.61,8.5
CHIP_EN: length 12.6
  Top Layer w0.178: SW1.1 0.61,15.36 0.61,21.14 C31.1 2.62,22.29 ; 2.62,22.29 2.59,22.33 ; 2.62,22.29 3.61,21.31 4.37,21.31 4.61,21.07 U20.7
CHRG: length 11.4
  Top Layer w0.254: LED4.1 24.97,21.36 v2(24.97,20.35) ; v2(23.86,11.7) 23.85,11.72 U2.7
  Bottom Layer w0.254: v2(24.97,20.35) 24.97,12.85 23.86,11.75 v2(23.86,11.7)
GPIO2: length 3
  Top Layer w0.178: U20.6 5.11,21.25 4.65,21.72 3.86,21.72 3.36,22.21 R22.2
GPIO8: length 14.3
  Top Layer w0.178: LED2.1 4.49,7.36 3.56,8.28 3.56,9.33 3.84,9.6 ; R2.2 3.84,9.6 ; 3.84,9.6 3.84,9.65 2.81,10.67 2.81,15.25 2.16,15.9 2.16,16.87 2.64,17.35 3.37,17.35 U20.14
  Top Layer w0.254: R2.2 4.61,9.75 U6.3
GPIO9: length 12.9
  Top Layer w0.178: U20.15 2.76,16.83 2.58,16.65 2.58,16.06 3.21,15.43 3.21,11.1 v2(3.77,10.54) 4.46,10.54 R10.2
  Top Layer w0.254: U6.2 4.61,10.4 R10.2 ; v2(2.62,9.17) 2.22,9.17 SW2.1
  Bottom Layer w0.254: v2(3.77,10.54) 3.76,10.54 2.66,9.44 2.66,9.22 v2(2.62,9.17)
GPIO18/USB_DN: length 12.6
  Top Layer w0.203: v2(9.65,16.18) 9.5,16.33 U20.25
  Top Layer w0.254: R23.2 v2(18.1,20.45)
  Bottom Layer w0.203: v2(9.65,16.18) 12.93,16.18 15.27,18.52 16.99,18.52 17.73,19.25 17.73,20.08 v2(18.1,20.45)
GPIO19/USB_DP: length 11.7
  Top Layer w0.203: v2(9.7,16.99) 9.54,16.83 U20.26
  Top Layer w0.254: R24.2 v2(17.22,20.45)
  Bottom Layer w0.203: v2(9.7,16.99) 10.01,16.69 12.67,16.69 15.01,19.02 16.76,19.02 17.22,19.48 v2(17.22,20.45)
SCL: length 16.9
  Top Layer w0.203: v2(10.62,10.49) 10.62,12.17 10.13,12.65 10.13,13.79 10.66,14.32 U1.23
  Top Layer w0.254: U6.7 9.72,10.4 R3.2 9.84,10.49 v2(10.62,10.49) ; v2(14.74,3.65) 14.74,4.71 U21.4
  Bottom Layer w0.203: v2(14.74,3.65) 14.69,3.65 11.68,6.66 11.68,9.42 v2(10.62,10.49)
SDA: length 16.1
  Top Layer w0.203: U1.24 10.9,13.92 10.54,13.56 10.54,12.95 11.17,12.32 11.17,10.05 10.74,9.63 v2(10.62,9.63) ; 8.45,9.68 U6.6
  Top Layer w0.254: U21.3 13.74,4.76 v2(13.74,3.7) ; v2(10.62,9.63) 10.6,9.61 R19.1 9.7,9.75 U6.6
  Bottom Layer w0.203: v2(13.74,3.7) 11.15,6.29 11.15,9.09 v2(10.62,9.63)
STDBY: length 12.1
  Top Layer w0.254: U2.6 v2(22.58,11.76) ; LED3.1 23.93,21.33 v2(23.93,20.35)
  Bottom Layer w0.254: v2(23.93,20.35) 24.46,19.81 24.46,13.18 23.03,11.76 v2(22.58,11.76)
USB_CC1: length 1.7
  Top Layer w0.254: U4.A5 18.94,21.49 R16.2
USB_CC2: length 1.9
  Top Layer w0.254: R17.2 16.34,21.88 15.94,22.28 U4.B5
$1N3228: length 1.8
  Top Layer w0.254: 16.28,8.2 16.26,8.18 ; 16.28,8.2 16.33,8.26 ; 16.28,8.2 R6.2 ; 16.33,8.26 16.36,8.28 ; 16.33,8.26 LDO1.3
$1N3230: length 13.3
  Top Layer w0.254: C5.2 19.67,12.51 ; 19.67,11.75 C4.2
  Top Layer w0.5: 19.04,10.16 19.04,10.16 19.14,10.25 ; 19.14,10.25 v2(19.67,10.78) 19.67,12.51 ; 19.14,10.25 v2(19.14,9.56)
  Bottom Layer w0.6: v2(19.67,10.78) 19.14,10.25 v2(19.14,9.56) 19.14,8.84 17.21,6.91 17.21,4.43 18.26,3.39 U23.3
$1N3241: length 1.2
  Top Layer w0.254: R8.1 13.77,20.45 LED1.2
$1N3249: length 4.8
  Top Layer w0.254: R24.1 17.22,21.8 16.94,22.08 U4.B6 16.94,24.03 17.21,24.3 17.76,24.3 17.94,24.12 U4.A6
$1N3250: length 3.6
  Top Layer w0.254: R23.1 18.1,21.87 ; 18.1,21.87 18.44,22.21 U4.B7 ; 18.1,21.87 17.88,21.87 17.44,22.31 U4.A7
$1N3275: length 5.5
  Top Layer w0.178: C34.1 12,20.7 10.69,20.7 9.84,19.85 ; U20.30 8.77,18.83 9.79,19.85 9.84,19.85 ; 9.84,19.85 U7.1
$1N3278: length 2.4
  Top Layer w0.254: 7.71,22.07 R11.1 ; U20.1 7.61,22.84 R12.1
$1N3279: length 6.5
  Top Layer w0.254: R12.2 7.67,23.36 R21.1 7.67,24.54 5.31,26.89 5.31,28.34 4.96,28.69
$1N3283: length 5.2
  Top Layer w0.178: C33.2 11.58,18.11 U7.3 11.24,18.07 10.77,17.6 9.5,17.6 8.77,18.33 U20.29
$1N3292: length 1.2
  Top Layer w0.254: LED2.2 6.78,7.34
$1N3304: length 1.3
  Top Layer w0.2: C37.2 15.26,15.12 U1.10
$1N7546: length 2.3
  Top Layer w0.254: 23.88,22.45 23.87,22.44 ; 24.87,23.6 24.87,22.6 24.72,22.46 ; 24.72,22.46 LED4.2 ; 24.72,22.46 LED3.2
$1N7554: length 3.1
  Top Layer w0.254: U2.2 23.85,19.45 23.44,19.86 22.78,19.86 R4.2
$1N7596: length 1.6
  Top Layer w0.2: R13.1 14.93,15.52 14.04,15.52

## Copper pours and planes (outline as drawn; the poured copper is in the pictures)
GND on Top Layer: -3.84,35.22 30.69,35.22 30.69,-4 -3.84,-4
GND on Bottom Layer: -4.21,35.06 31.56,35.06 31.56,-5.02 -4.21,-5.02

## Text on the board
Top Silkscreen Layer: VCC | GND | SDA | SCL | BAT | 3V3 | VIN | 传感器 | REST | BOOT
